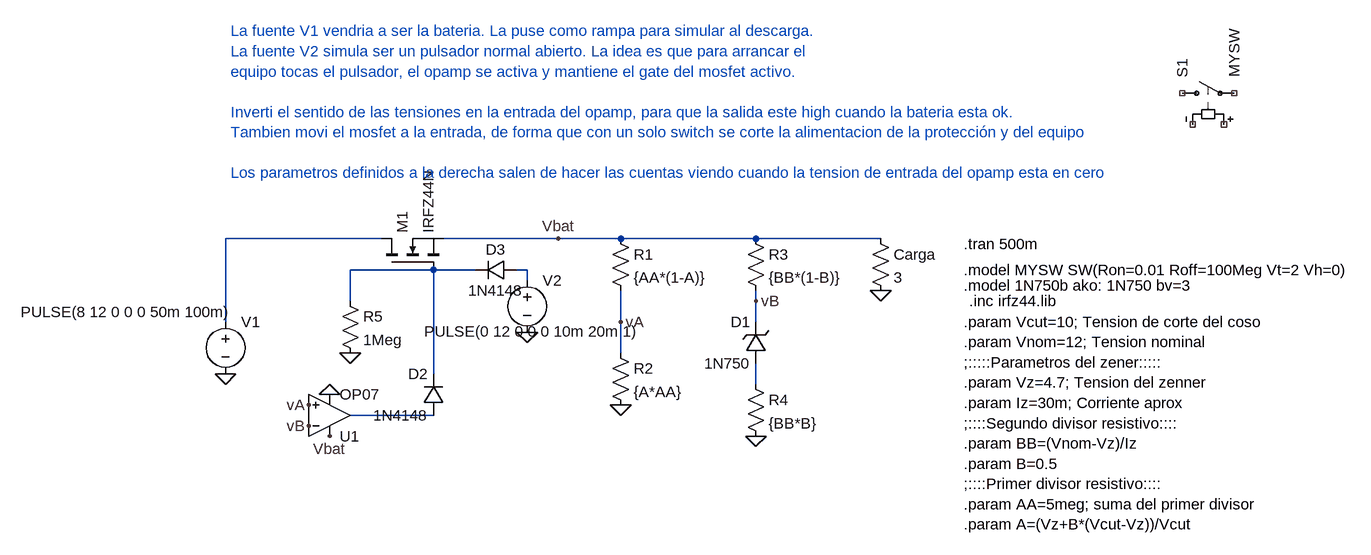
[diagram p0: schematic Limitador 10V.asc]
Limitador 10V.asc, the LTspice schematic file:
Version 4
SHEET 1 1956 684
WIRE -144 48 -384 48
WIRE 128 48 -48 48
WIRE 224 48 128 48
WIRE 432 48 224 48
WIRE 624 48 432 48
WIRE -64 96 -192 96
WIRE 0 96 -64 96
WIRE 80 96 64 96
WIRE 80 112 80 96
WIRE -192 144 -192 96
WIRE 432 144 432 128
WIRE -384 176 -384 48
WIRE 224 176 224 128
WIRE 432 176 432 144
WIRE 224 224 224 176
WIRE -64 256 -64 96
WIRE 432 272 432 240
WIRE -64 320 -192 320
FLAG -384 256 0
FLAG 224 304 0
FLAG 432 352 0
FLAG 224 176 vA
FLAG 432 144 vB
FLAG -224 288 0
FLAG 128 48 Vbat
FLAG -224 352 Vbat
FLAG -256 336 vB
FLAG -256 304 vA
FLAG 624 128 0
FLAG 80 192 0
FLAG -192 224 0
SYMBOL voltage -384 160 R0
WINDOW 123 0 0 Left 0
WINDOW 39 0 0 Left 0
WINDOW 3 -315 1 Left 2
SYMATTR InstName V1
SYMATTR Value PULSE(8 12 0 0 0 50m 100m)
SYMBOL res 208 32 R0
SYMATTR InstName R1
SYMATTR Value {AA*(1-A)}
SYMBOL res 208 208 R0
SYMATTR InstName R2
SYMATTR Value {A*AA}
SYMBOL res 416 32 R0
SYMATTR InstName R3
SYMATTR Value {BB*(1-B)}
SYMBOL res 416 256 R0
SYMATTR InstName R4
SYMATTR Value {BB*B}
SYMBOL Opamps\\OP07 -224 384 M180
SYMATTR InstName U1
SYMBOL sw 1072 -176 R270
SYMATTR InstName S1
SYMATTR Value MYSW
SYMBOL res 608 32 R0
SYMATTR InstName Carga
SYMATTR Value 3
SYMBOL zener 448 240 R180
WINDOW 0 24 64 Left 2
WINDOW 3 24 0 Left 2
SYMATTR InstName D1
SYMATTR Value 1N750
SYMBOL diode -48 320 R180
WINDOW 0 24 64 Left 2
WINDOW 3 24 0 Left 2
SYMATTR InstName D2
SYMATTR Value 1N4148
SYMBOL voltage 80 96 R0
WINDOW 3 -158 95 Left 2
WINDOW 123 0 0 Left 0
WINDOW 39 0 0 Left 0
SYMATTR InstName V2
SYMATTR Value PULSE(0 12 0 0 0 10m 20m 1)
SYMBOL diode 64 80 R90
WINDOW 0 0 32 VBottom 2
WINDOW 3 32 32 VTop 2
SYMATTR InstName D3
SYMATTR Value 1N4148
SYMBOL nmos -144 96 R270
SYMATTR InstName M1
SYMATTR Value IRFZ44N
SYMBOL res -208 128 R0
SYMATTR InstName R5
SYMATTR Value 1Meg
TEXT 752 56 Left 2 !.tran 500m
TEXT 752 96 Left 2 !.model MYSW SW(Ron=0.01 Roff=100Meg Vt=2 Vh=0)
TEXT 752 176 Left 2 !.param Vcut=10; Tension de corte del coso\n.param Vnom=12; Tension nominal\n;:::::Parametros del zener:::::\n.param Vz=4.7; Tension del zenner\n.param Iz=30m; Corriente aprox\n;::::Segundo divisor resistivo::::\n.param BB=(Vnom-Vz)/Iz\n.param B=0.5\n;::::Primer divisor resistivo::::\n.param AA=5meg; suma del primer divisor\n.param A=(Vz+B*(Vcut-Vz))/Vcut
TEXT 752 120 Left 2 !.model 1N750b ako: 1N750 bv=3
TEXT -376 -272 Left 2 ;La fuente V1 vendria a ser la bateria. La puse como rampa para simular al descarga.\nLa fuente V2 simula ser un pulsador normal abierto. La idea es que para arrancar el\nequipo tocas el pulsador, el opamp se activa y mantiene el gate del mosfet activo.\n \nInverti el sentido de las tensiones en la entrada del opamp, para que la salida este high cuando la bateria esta ok.\nTambien movi el mosfet a la entrada, de forma que con un solo switch se corte la alimentacion de la protección y del equipo\n \nLos parametros definidos a la derecha salen de hacer las cuentas viendo cuando la tension de entrada del opamp esta en cero
TEXT 760 144 Left 2 !.inc irfz44.lib

The netlist it stands for:
* Limitador 10V.asc
V1 N001 0 PULSE(8 12 0 0 0 50m 100m)
R1 Vbat vA {AA*(1-A)}
R2 vA 0 {A*AA}
R3 Vbat vB {BB*(1-B)}
R4 N004 0 {BB*B}
XU1 vA vB Vbat 0 N005 LT1001  ; OP07, pins In+ In- V+ V- OUT
S1 NC_01 NC_02 NC_03 NC_04 MYSW
R§Carga Vbat 0 3
D1 N004 vB 1N750
D2 N005 N002 1N4148
V2 N003 0 PULSE(0 12 0 0 0 10m 20m 1)
D3 N003 N002 1N4148
M1 N001 N002 Vbat Vbat IRFZ44N
R5 N002 0 1Meg
.model D D
.lib standard.dio
.model NMOS NMOS
.model PMOS PMOS
.lib standard.mos
.tran 500m
.model MYSW SW(Ron=0.01 Roff=100Meg Vt=2 Vh=0)
.param Vcut=10; Tension de corte del coso
.param Vnom=12; Tension nominal
;:::::Parametros del zener:::::
.param Vz=4.7; Tension del zenner
.param Iz=30m; Corriente aprox
;::::Segundo divisor resistivo::::
.param BB=(Vnom-Vz)/Iz
.param B=0.5
;::::Primer divisor resistivo::::
.param AA=5meg; suma del primer divisor
.param A=(Vz+B*(Vcut-Vz))/Vcut
.model 1N750b ako: 1N750 bv=3
* La fuente V1 vendria a ser la bateria. La puse como rampa para simular al descarga.
* La fuente V2 simula ser un pulsador normal abierto. La idea es que para arrancar el
* equipo tocas el pulsador, el opamp se activa y mantiene el gate del mosfet activo.
* Inverti el sentido de las tensiones en la entrada del opamp, para que la salida este high cuando la bateria esta ok.
* Tambien movi el mosfet a la entrada, de forma que con un solo switch se corte la alimentacion de la protección y del equipo
* Los parametros definidos a la derecha salen de hacer las cuentas viendo cuando la tension de entrada del opamp esta en cero
.inc irfz44.lib
.lib LTC.lib
.backanno
.end